# EasyEDA schematic TestSensorE469.json
TITLE: Sheet_1; REV: 1.0; Date: 2022-11-23; Sheet: 1/1; Company: Your Company
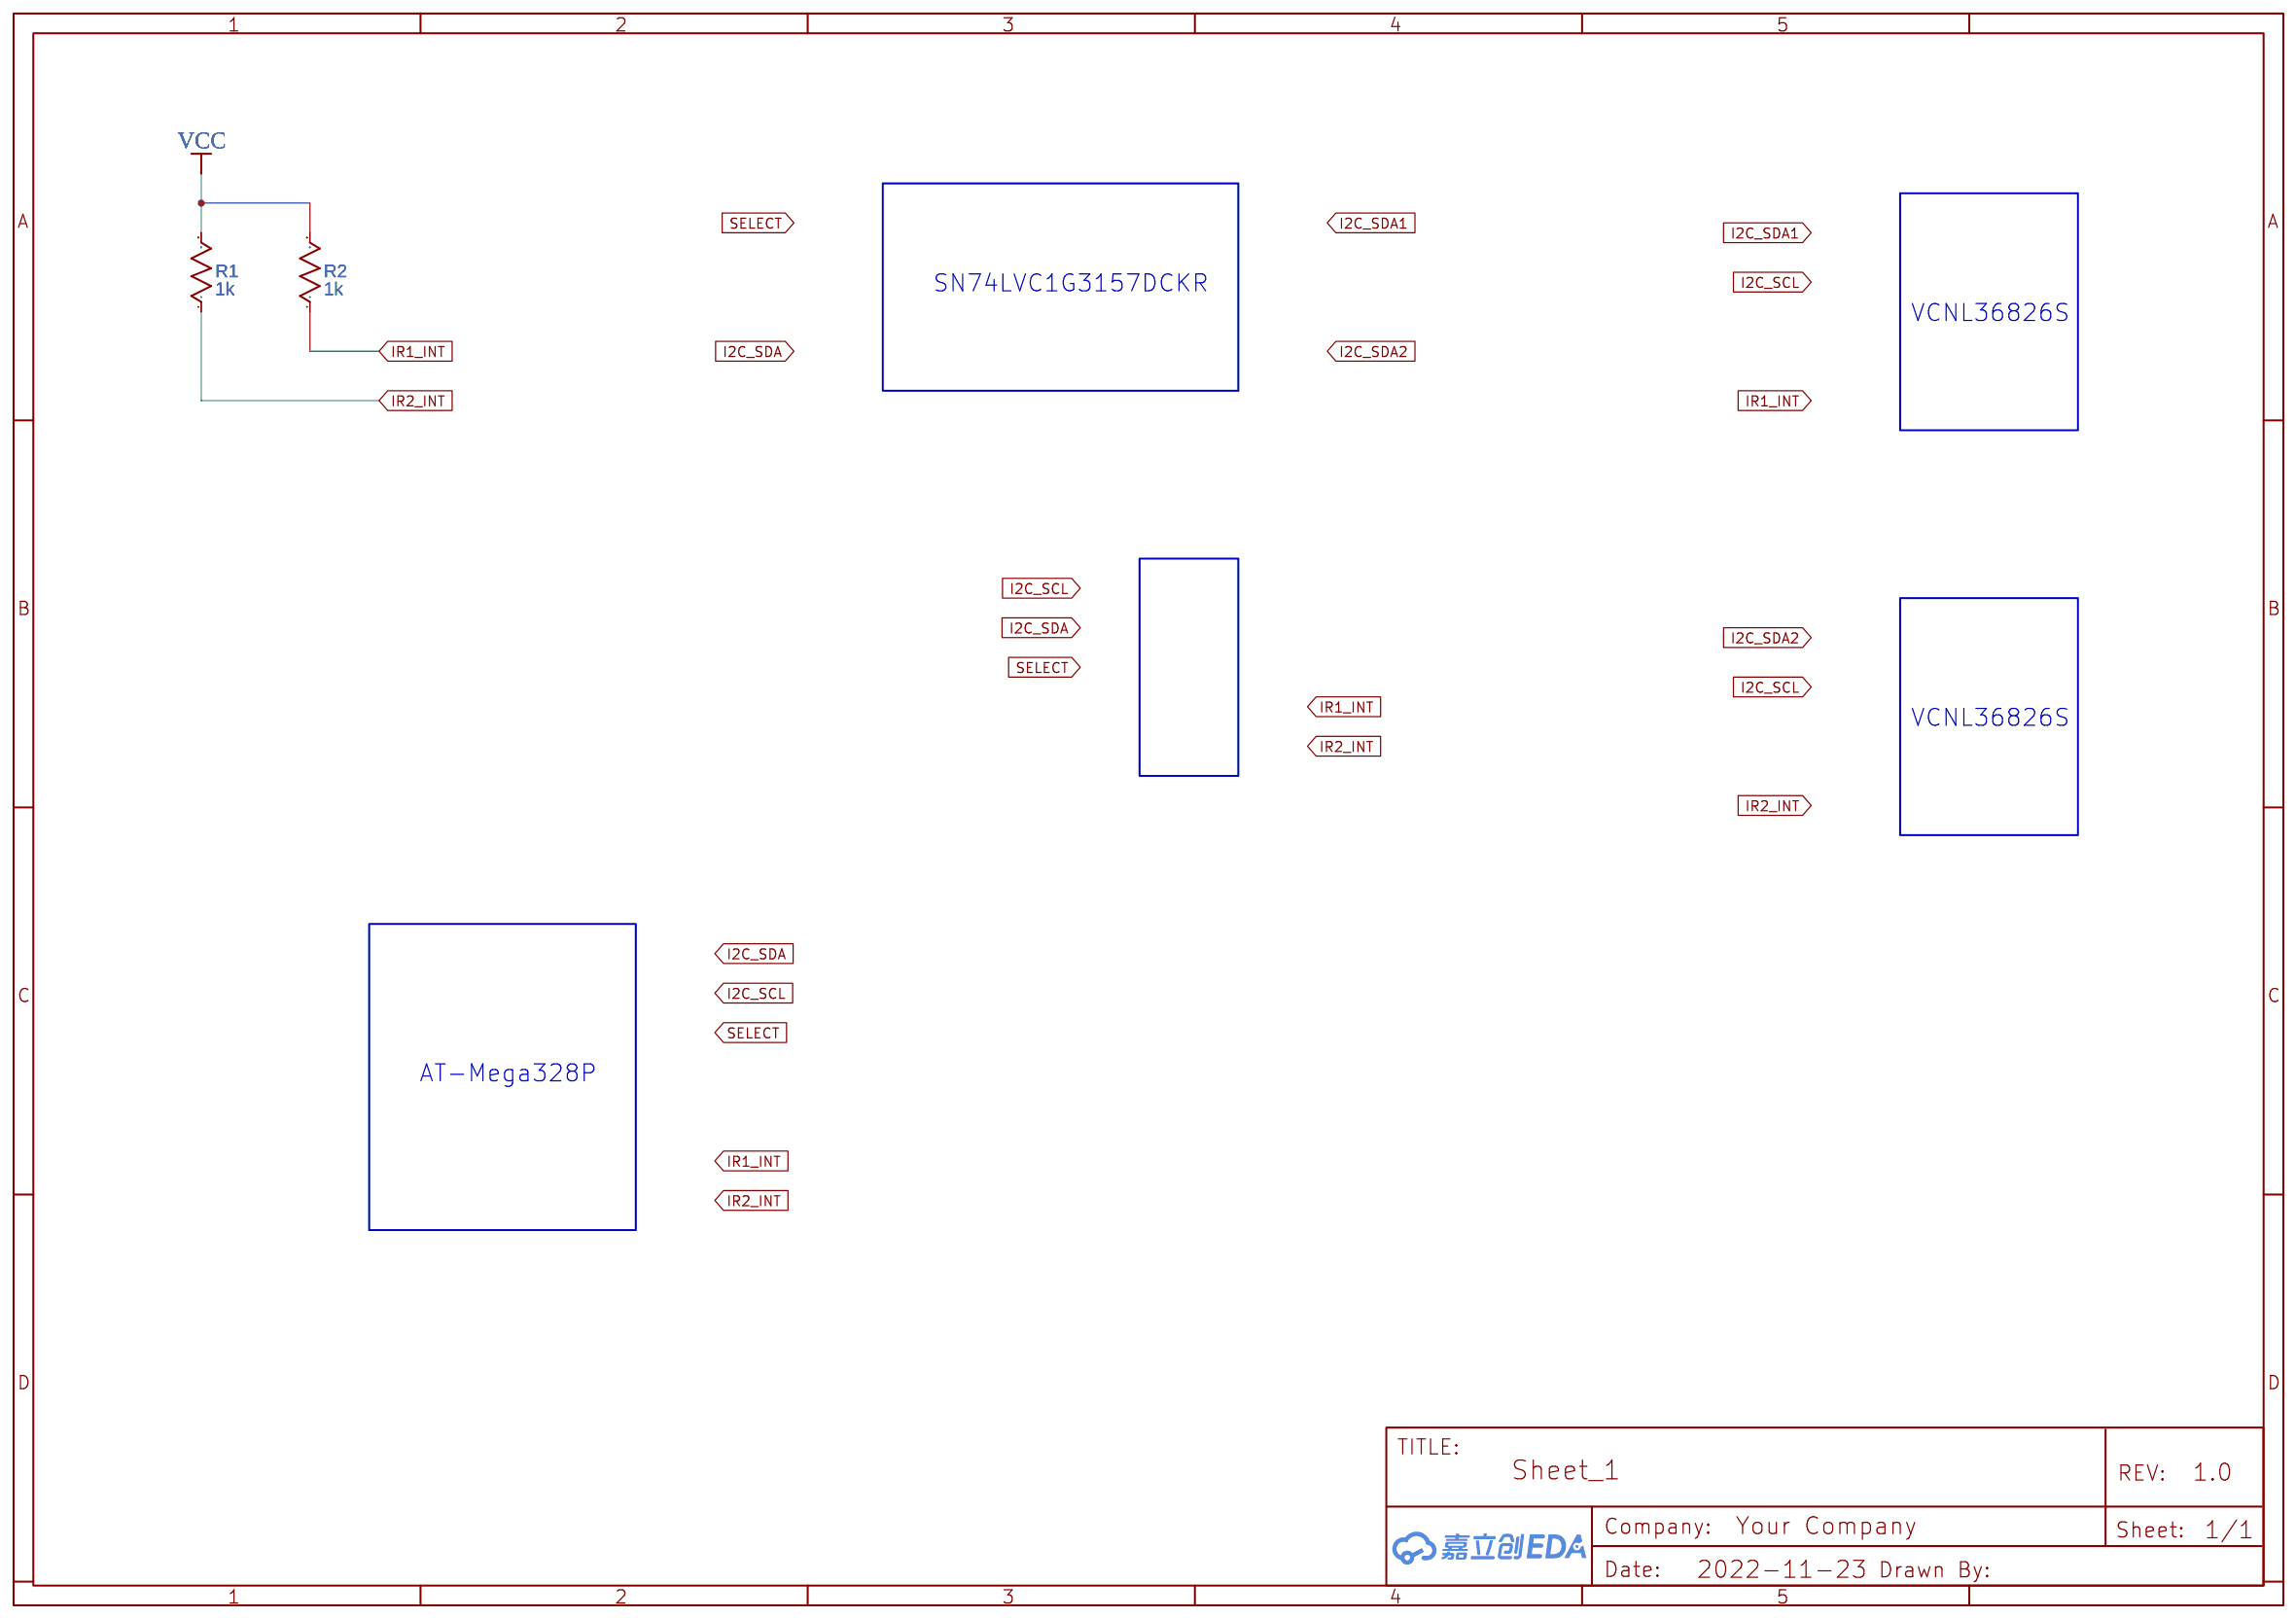
[diagram p0: schematic sheet]

## Parts
R1  1k  [R0603]
R2  1k  [R0603]

## Library data of the parts
R1 R2 = R_0603_US: Contributor: LCEDA_Lib

## Nets
VCC: R1.2 R2.2
IR1_INT: R2.1
IR2_INT: R1.1

## Notes on the sheet
- SN74LVC1G3157DCKR
- VCNL36826S
- VCNL36826S
- AT-Mega328P
